# EAGLE schematic v1-hbridge (EAGLE 6.4)
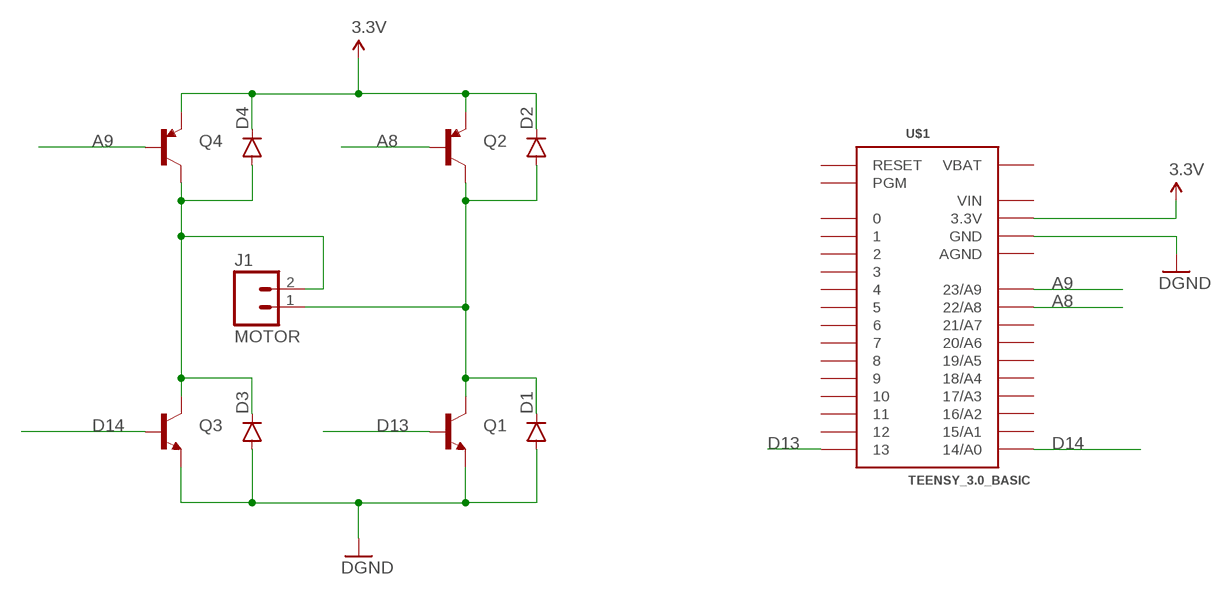
[diagram p0: schematic, sheet 1]

## Parts
D1  DIODE  [DIODE-1N4001-KIT]
D2  DIODE  [DIODE-1N4001-KIT]
D3  DIODE  [DIODE-1N4001-KIT]
D4  DIODE  [DIODE-1N4001-KIT]
J1  MOTOR  M02LOCK  [1X02_LOCK]
Q1  TRANSISTOR_NPNBC547  [TO-92-AMMO]
Q2  TRANSISTOR_PNPTO92  [TO-92]
Q3  TRANSISTOR_NPNBC547  [TO-92-AMMO]
Q4  TRANSISTOR_PNPTO92  [TO-92]
U$1  TEENSY_3.0_BASIC  [TEENSY_3.0_BASIC]

## Nets
3.3V: D2.C D4.C Q2.1(E) Q4.1(E) U$1.3.3V U$1.3.3V1(3.3V)
A8: Q2.2(B) U$1.22/A8
A9: Q4.2(B) U$1.23/A9
D13: Q1.2(B) U$1.13
D14: Q3.2(B) U$1.14/A0
GND: D1.A D3.A Q1.3(E) Q3.3(E) U$1.GND U$1.GND1(GND) ; supply symbol labelled DGND
N$1: D3.C D4.A J1.2 Q3.1(C) Q4.3(C)
N$2: D1.C D2.A J1.1 Q1.1(C) Q2.3(C)
Unconnected: U$1.0 U$1.1 U$1.2 U$1.3 U$1.4 U$1.5 U$1.6 U$1.7 U$1.8 U$1.9 U$1.10 U$1.11 U$1.12 U$1.15/A1 U$1.16/A2 U$1.17/A3 U$1.18/A4 U$1.19/A5 U$1.20/A6 U$1.21/A7 U$1.PGM U$1.RESET

## Power pins joined to a net without a drawn wire
AGND: U$1.AGND
VBAT: U$1.VBAT
VIN: U$1.VIN

## Library data of the parts
D1-D4 = SparkFun-DiscreteSemi:DIODE: Diode These are standard reverse protection diodes and small signal diodes. SMA package can handle up to about 1A. SOD-323 can handle about 200mA. What the SOD-323 package when ordering, there are some mfgs out there that are 5-pin packages.
J1 = SparkFun-Connectors:M02: Standard 2-pin 0.1" header. Use with - straight break away headers ( PRT-00116) - right angle break away headers (PRT-00553) - swiss pins (PRT-00743) - machine pins (PRT-00117) - female headers (PRT-00115) Molex polarized connector foot print use with: PRT-08233 with associated crimp pins and housings. 2.54_SCREWTERM for use with PRT-10571. 3.5mm Screw Terminal footprints for PRT-08084 5mm Screw Terminal footprints for use with PRT-08433
Q1 Q3 = SparkFun-DiscreteSemi:TRANSISTOR_NPN: Generic NPN BJT MMBT2222A - TRANS-08049 (SOT-23, 1A 40V) MPSA42 - TRANS-09116 (SOT-23, 500mA 300V) MMBT5088LT1G - TRANS-11160 (SOT-23, 50 mA 30V) BC547 - COM-08928 <http://www.sparkfun.com/products/8928> (TO-92 45V 100mA) (1.Collector 2.Base 3.Emitter) 2N3904 - COM-00521 <http://www.sparkfun.com/products/521> (TO-92 40V 200mA) (1.Emitter 2.Base 3.Collector) P2N2222A - COM-12852 <http://www.sparkfun.com/products/12852> (TO-92 40V 600mA) (1.Collector 2.Base 3.Emitter)
Q2 Q4 = SparkFun-DiscreteSemi:TRANSISTOR_PNP: Generic PNP BJT Double check pinouts against datasheets- not all devices are the same! MMBT3906 - 40V 200mA SOT-23 (TRANS-08052) MMBT4403 - 40V 600mA SOT-23 (TRANS-09245)
U$1 = Teensy3.0:TEENSY_3.0_BASIC: Basic Teensy 3.0 with none of the 'inner' pins enabled. See '+4', 'AllAnalogPins", and 'AllPins' packages for additional pin holes, as needed.